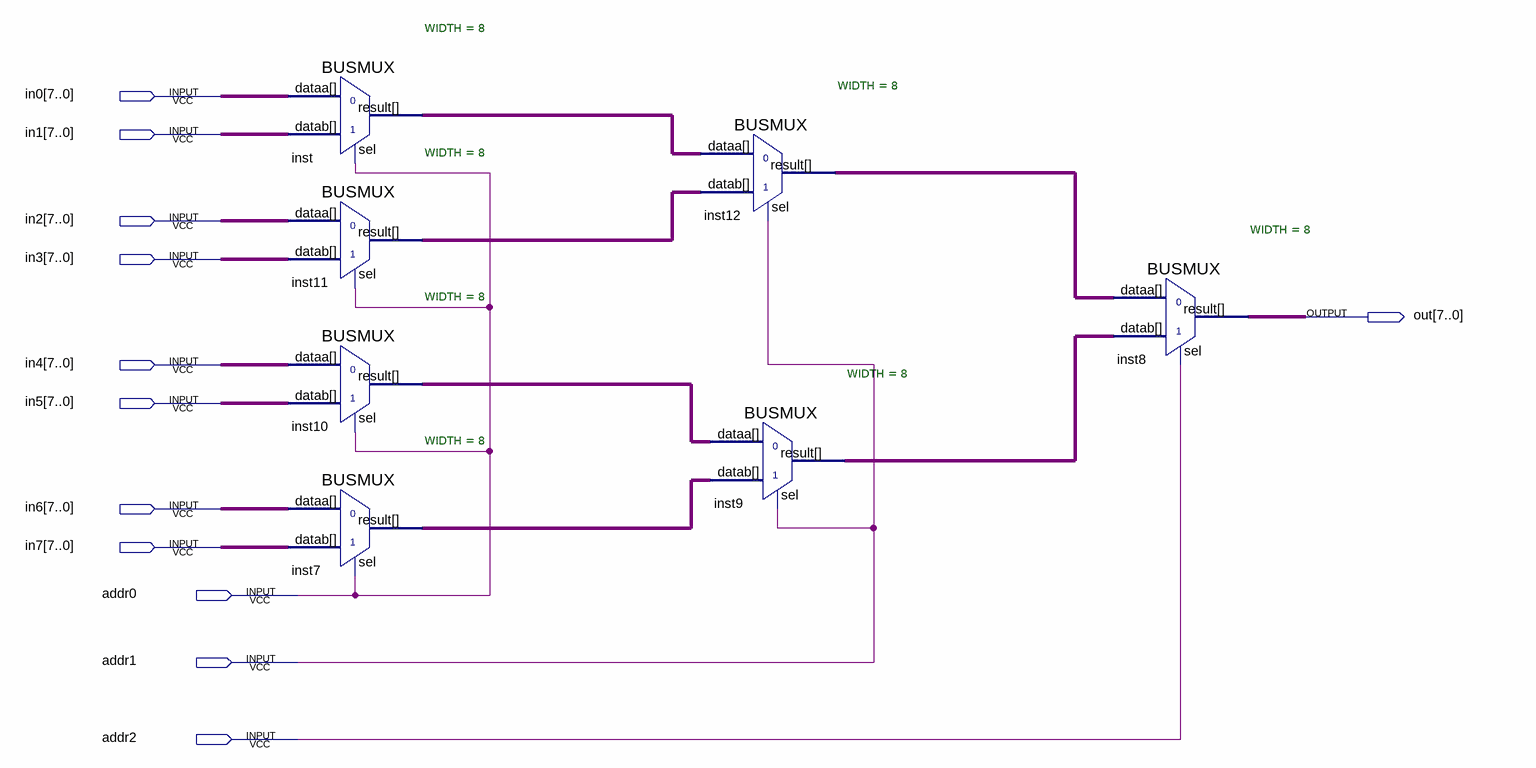
[diagram p0: schematic sheet]
// Quartus schematic bus_muw_8.bdf as structural Verilog: 7 symbols, 12 pins
module bus_muw_8 (
  input  [7:0] in0,
  input  [7:0] in1,
  input  [7:0] in2,
  input  [7:0] in3,
  input  [7:0] in4,
  input  [7:0] in5,
  input  [7:0] in6,
  input  [7:0] in7,
  input  addr0,
  input  addr1,
  input  addr2,
  output [7:0] out
);

  wire [7:0] inst7_result, inst9_result, inst10_result, inst11_result, inst12_result, inst_result;

  BUSMUX #(.WIDTH(8)) inst (.datab(in1), .sel(addr0), .dataa(in0), .result(inst_result));
  BUSMUX #(.WIDTH(8)) inst11 (.datab(in3), .sel(addr0), .dataa(in2), .result(inst11_result));
  BUSMUX #(.WIDTH(8)) inst10 (.datab(in5), .sel(addr0), .dataa(in4), .result(inst10_result));
  BUSMUX #(.WIDTH(8)) inst7 (.datab(in7), .sel(addr0), .dataa(in6), .result(inst7_result));
  BUSMUX #(.WIDTH(8)) inst12 (.datab(inst11_result), .sel(addr1), .dataa(inst_result), .result(inst12_result));
  BUSMUX #(.WIDTH(8)) inst9 (.datab(inst7_result), .sel(addr1), .dataa(inst10_result), .result(inst9_result));
  BUSMUX #(.WIDTH(8)) inst8 (.datab(inst9_result), .sel(addr2), .dataa(inst12_result), .result(out));
endmodule
